# Altium schematic sheet 4-Keyboard.SchDoc
size A; SheetNumber: 1; SheetTotal: 1
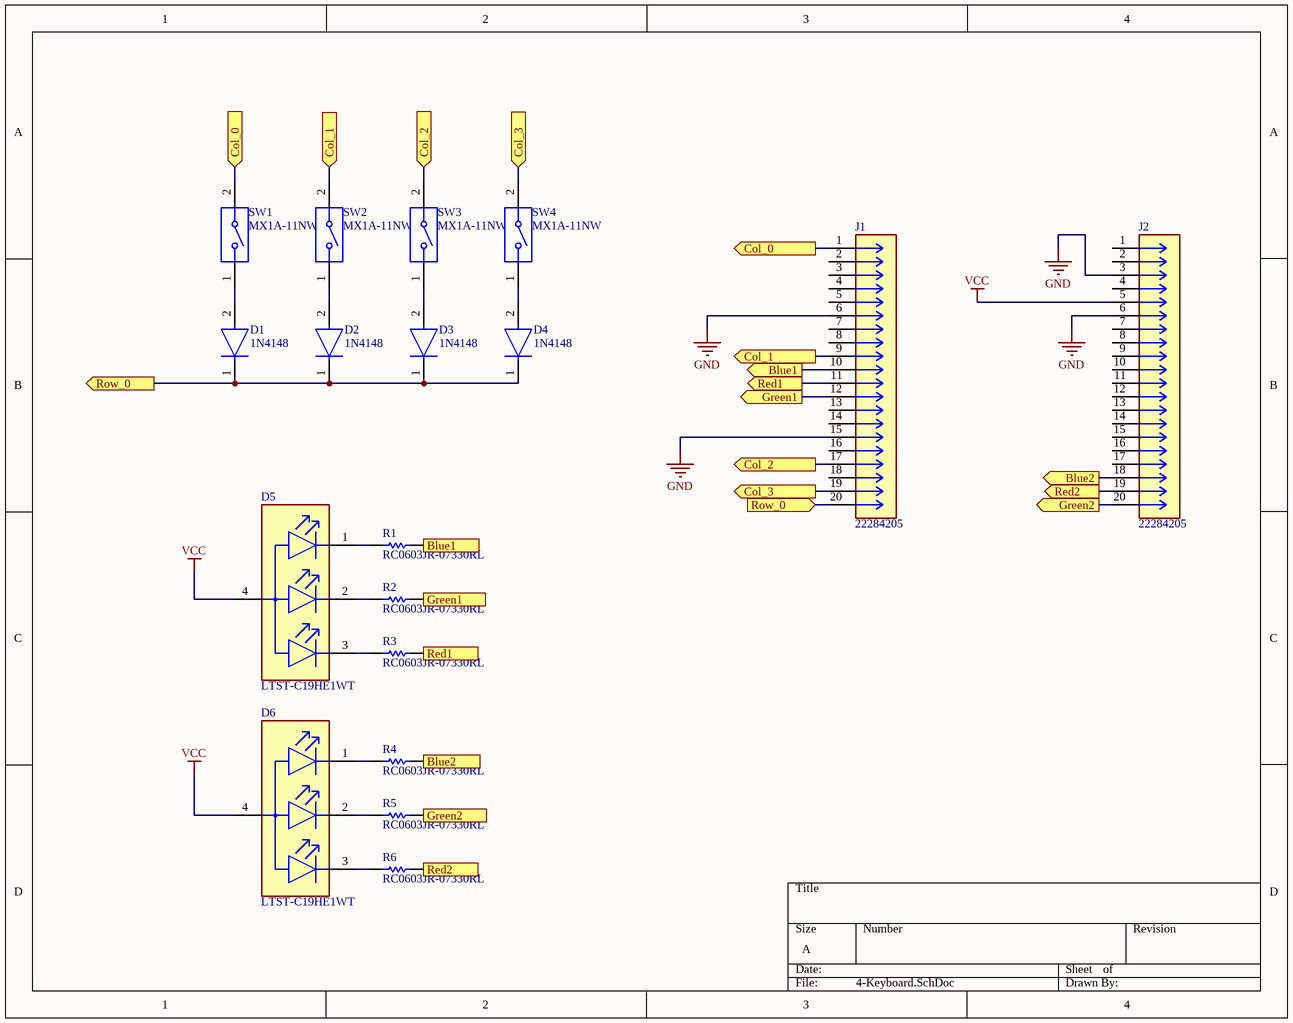
[diagram p0: 4-Keyboard.SchDoc]

## Parts
D1  1N4148  [FP-017AG-MFG]
D2  1N4148  [FP-017AG-MFG]
D3  1N4148  [FP-017AG-MFG]
D4  1N4148  [FP-017AG-MFG]
D5  LTST-C19HE1WT  [FP-LTST-C19HE1WT-MFG]
D6  LTST-C19HE1WT  [FP-LTST-C19HE1WT-MFG]
J1  22284205  [CONN_SD-42375-001_M295_20_MOL]
J2  22284205  [CONN_SD-42375-001_M295_20_MOL]
R1  RC0603JR-07330RL  [RESC1608X55X25LL10T15]
R2  RC0603JR-07330RL  [RESC1608X55X25LL10T15]
R3  RC0603JR-07330RL  [RESC1608X55X25LL10T15]
R4  RC0603JR-07330RL  [RESC1608X55X25LL10T15]
R5  RC0603JR-07330RL  [RESC1608X55X25LL10T15]
R6  RC0603JR-07330RL  [RESC1608X55X25LL10T15]
SW1  MX1A-11NW  [CHRY-MX1A-11NW_V]
SW2  MX1A-11NW  [CHRY-MX1A-11NW_V]
SW3  MX1A-11NW  [CHRY-MX1A-11NW_V]
SW4  MX1A-11NW  [CHRY-MX1A-11NW_V]

## Ports
Blue1 (in), Blue1 (out), Blue2 (in), Blue2 (out), Col_0 (in), Col_0 (out), Col_1 (in), Col_1 (out), Col_2 (in), Col_2 (out), Col_3 (in), Col_3 (out), Green1 (in), Green1 (out), Green2 (in), Green2 (out), Red1 (in), Red1 (out), Red2 (in), Red2 (out), Row_0 (in), Row_0 (out)

## Nets
GND: J1.6 J1.15 J2.3 J2.6
VCC: D5.4(A) D6.4(A) J2.5
Blue1: J1.10 R1.2 ; port Blue1
Blue2: J2.18 R4.2 ; port Blue2
Col_0: J1.1 SW1.2 ; port Col_0
Col_1: J1.9 SW2.2 ; port Col_1
Col_2: J1.17 SW3.2 ; port Col_2
Col_3: J1.19 SW4.2 ; port Col_3
Green1: J1.12 R2.2 ; port Green1
Green2: J2.20 R5.2 ; port Green2
Red1: J1.11 R3.2 ; port Red1
Red2: J2.19 R6.2 ; port Red2
Row_0: D1.1(C) D2.1(C) D3.1(C) D4.1(C) J1.20 ; port Row_0
NetD1_2: D1.2(A) SW1.1
NetD2_2: D2.2(A) SW2.1
NetD3_2: D3.2(A) SW3.1
NetD4_2: D4.2(A) SW4.1
NetD5_1: D5.1(RED_C) R1.1
NetD5_2: D5.2(GREEN_C) R2.1
NetD5_3: D5.3(BLUE_C) R3.1
NetD6_1: D6.1(RED_C) R4.1
NetD6_2: D6.2(GREEN_C) R5.1
NetD6_3: D6.3(BLUE_C) R6.1

Not connected (* = marked no-connect by the designer): J1 2 3 4 5 7 8 13 14 16 18; J2 1 2 4 7 8 9 10 11 12 13 14 15 16 17

## Library data of the parts
D1-D4 = CMP-07163-000046-1: DIODE GEN PURP 100V 200MA DO35; Forward Voltage: 1V; Max Power Dissipation: 500mW; Max Reverse Current: 5uA; Forward Current: 300mA; Current: 4A; Reverse Recovery Time: 4ns; Element Configuration: Single; Outside Diameter: 1.85mm; Capacitance: 4pF; Polarity: Standard; Max Forward Surge Current (Ifsm): 1A; Reverse Voltage: 100V; Output Current: 200mA; Average Rectified Current: 200mA; Diameter: 1.91mm; Max Repetitive Reverse Voltage (Vrrm): 100V; Current Rating: 200mA; Case/Package: DO-35; Lead Free: Lead Free; Number of Pins: 2; Recovery Time: 4ns; Packaging: Bulk; Contact Plating: Tin; Voltage: 100V; Mount: Through Hole; Max Surge Current: 4A; Package Quantity: 2000; Width: 1.91mm; Max Reverse Voltage (DC): 100V; Length: 4.56mm; Radiation Hardening: No; Power Dissipation: 500mW; Voltage Rating (DC): 100V; Peak Non-Repetitive Surge Current: 4A; REACH SVHC: No SVHC; Height: 4.56mm; Max Operating Temperature: 175°C; Series: -; Weight: 0.01lb; Min Operating Temperature: -65°C
D5 D6 = CMP-2000-05201-2: LED RGB DIFFUSED CHIP SMD; Number of LEDs: 3; Test Current: 20mA; Luminous Intensity: 180mcd; Lens Color: White; Dominant Wavelength: 470nm; Color: Blue; Reverse Voltage: 5V; Viewing Angle: 130°; Forward Voltage: 3.35V; Max Operating Temperature: 80°C; Packaging: Tape and Reel; Lens Transparency: Diffused; Width: 1.6mm; Case Code (Metric): 1616; Height: 0.35mm; Lens Style: Diffused; Mount: Surface Mount; Package Quantity: 3000; Radiation Hardening: No; Length: 1.6mm; Case/Package: 0606; Forward Current: 20mA; Case Code (Imperial): 0606; Lead Free: Lead Free; Min Operating Temperature: -20°C; Number of Elements: 3; Number of Pins: 4; Depth: 1.6mm
R1-R6 = CMP-2000-06958-1: Chip Resistor, 330 Ohm, +/- 5%, 50 V, -55 to 155 degC, 0603 (1608 Metric), -40 to 155 degC, RoHS, Tape and Reel; Manufacturer: Yageo; Temperature Coefficient: ±100ppm/°C; Power Rating: 100mW; Voltage Rating: 50V; Product Range: RCSeries; SVHC: ToBeAdvised; Resistance: 330ohm; Resistor Element Type: ThickFilm; Resistor Case Style: 0603[1608Metric]; Manufacturer URL: http://www.yageo.com/; Packaging: CutTape; Mounting Technology: SurfaceMount; Automotive Qualification Standard: -; MSL: MSL1-Unlimited; Datasheet URL: http://www.yageo.com/documents/recent/PYu-RC_Group_51_RoHS_L_7.pdf; Package Reference: 0603; Package Description: 2-Pin Surface Mount Device, Body 1.6 x 0.8 mm; Resistance Tolerance: ±5%; Datasheet Version: Rev. 7, 05/2017
SW1-SW4 = CMP-2000-06786-1: Keylock Switch, 12 V, -10 to 70 degC, 2-Pin THD, RoHS, Bulk; Manufacturer: Cherry; Part No: MX1A11NW; Maximum DC Voltage Rating: 12V; COO: UK; Row Spacing: 6.35mm; Pole Throw Configuration: SPST; Total Travel: 4.06mm; Illumination Type: N/R; Actuator Style: Button; Operating Force: 0.58N; Electrical Life: 50000000Cycle; Minimum Insulation Resistance: 100MOhm; Body Orientation: Straight; Actuator Length: 3.6mm; Switch Configuration: N.O.; Maximum Current Rating: 0.01A; Maximum Contact Resistance: 200mOhm; Actuator Color: N/A; Terminal Type: PCPins; Operating Temperature: -10to70C; Number of Terminals: 2; Operating Speed: N/A; Maximum AC Voltage Rating: 12V; Housing Material: N/A; Datasheet URL: https://cdn.sparkfun.com/datasheets/Components/Switches/MX%20Series.pdf; Type: DesktopProfile; Terminal Pitch: 2.54mm; Package Reference: MX1A-11NW; ECCN: EAR99; Family: MX; Packaging: N/A; HTS: 8536509065; Actuator Material: N/A; Package Description: 2-Pin Through Hole Device, Body 15.6 x 15.6 mm; Dielectric Strength: N/A; Illumination Color: N/R; Manufacturer URL: http://cherryswitches.com/cn/; Dimension: 15.6x15.6x15.2mm; Mechanical Life: N/A; RoHS: Unknown; Contact Plating: N/A; Supplier: CherryElectrical; Contact Material: Silver/Gold; IP Rating: N/A; Mounting: ThroughHole; Datasheet Version: 09/2000; Maximum Power Rating: N/A; Mounting Technology: ThroughHole
J1 J2 = 22284205: Package: None; Price: None; Value: *; MP: 22284205; Availability: Unavailable